# Altium schematic sheet PS_DDR4.SchDoc
size A3
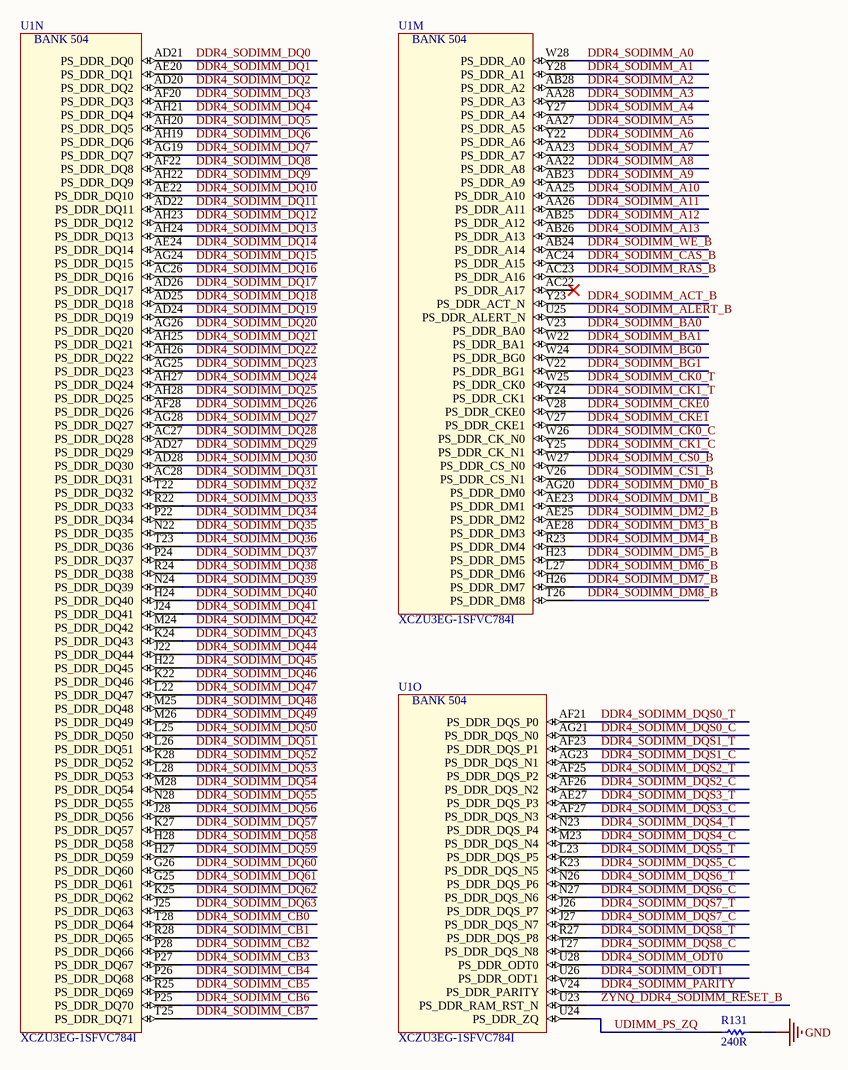
[diagram p0: PS_DDR4.SchDoc]

## Parts
R131  value 240R  [RESC1005L_0402]  (hidden comment: RES0402_240R_0W1_1T)
U1  XCZU3EG-1SFVC784I  [BGA784x28]  (parts M,N,O of 22)

## Nets
GND: R131.1
DDR4_SODIMM_A0: U1.W28(PS_DDR_A0)
DDR4_SODIMM_A1: U1.Y28(PS_DDR_A1)
DDR4_SODIMM_A2: U1.AB28(PS_DDR_A2)
DDR4_SODIMM_A3: U1.AA28(PS_DDR_A3)
DDR4_SODIMM_A4: U1.Y27(PS_DDR_A4)
DDR4_SODIMM_A5: U1.AA27(PS_DDR_A5)
DDR4_SODIMM_A6: U1.Y22(PS_DDR_A6)
DDR4_SODIMM_A7: U1.AA23(PS_DDR_A7)
DDR4_SODIMM_A8: U1.AA22(PS_DDR_A8)
DDR4_SODIMM_A9: U1.AB23(PS_DDR_A9)
DDR4_SODIMM_A10: U1.AA25(PS_DDR_A10)
DDR4_SODIMM_A11: U1.AA26(PS_DDR_A11)
DDR4_SODIMM_A12: U1.AB25(PS_DDR_A12)
DDR4_SODIMM_A13: U1.AB26(PS_DDR_A13)
DDR4_SODIMM_ACT_B: U1.Y23(PS_DDR_ACT_N)
DDR4_SODIMM_ALERT_B: U1.U25(PS_DDR_ALERT_N)
DDR4_SODIMM_BA0: U1.V23(PS_DDR_BA0)
DDR4_SODIMM_BA1: U1.W22(PS_DDR_BA1)
DDR4_SODIMM_BG0: U1.W24(PS_DDR_BG0)
DDR4_SODIMM_BG1: U1.V22(PS_DDR_BG1)
DDR4_SODIMM_CAS_B: U1.AC24(PS_DDR_A15)
DDR4_SODIMM_CB0: U1.T28(PS_DDR_DQ64)
DDR4_SODIMM_CB1: U1.R28(PS_DDR_DQ65)
DDR4_SODIMM_CB2: U1.P28(PS_DDR_DQ66)
DDR4_SODIMM_CB3: U1.P27(PS_DDR_DQ67)
DDR4_SODIMM_CB4: U1.P26(PS_DDR_DQ68)
DDR4_SODIMM_CB5: U1.R25(PS_DDR_DQ69)
DDR4_SODIMM_CB6: U1.P25(PS_DDR_DQ70)
DDR4_SODIMM_CB7: U1.T25(PS_DDR_DQ71)
DDR4_SODIMM_CK0_C: U1.W26(PS_DDR_CK_N0)
DDR4_SODIMM_CK0_T: U1.W25(PS_DDR_CK0)
DDR4_SODIMM_CK1_C: U1.Y25(PS_DDR_CK_N1)
DDR4_SODIMM_CK1_T: U1.Y24(PS_DDR_CK1)
DDR4_SODIMM_CKE0: U1.V28(PS_DDR_CKE0)
DDR4_SODIMM_CKE1: U1.V27(PS_DDR_CKE1)
DDR4_SODIMM_CS0_B: U1.W27(PS_DDR_CS_N0)
DDR4_SODIMM_CS1_B: U1.V26(PS_DDR_CS_N1)
DDR4_SODIMM_DM0_B: U1.AG20(PS_DDR_DM0)
DDR4_SODIMM_DM1_B: U1.AE23(PS_DDR_DM1)
DDR4_SODIMM_DM2_B: U1.AE25(PS_DDR_DM2)
DDR4_SODIMM_DM3_B: U1.AE28(PS_DDR_DM3)
DDR4_SODIMM_DM4_B: U1.R23(PS_DDR_DM4)
DDR4_SODIMM_DM5_B: U1.H23(PS_DDR_DM5)
DDR4_SODIMM_DM6_B: U1.L27(PS_DDR_DM6)
DDR4_SODIMM_DM7_B: U1.H26(PS_DDR_DM7)
DDR4_SODIMM_DM8_B: U1.T26(PS_DDR_DM8)
DDR4_SODIMM_DQ0: U1.AD21(PS_DDR_DQ0)
DDR4_SODIMM_DQ1: U1.AE20(PS_DDR_DQ1)
DDR4_SODIMM_DQ2: U1.AD20(PS_DDR_DQ2)
DDR4_SODIMM_DQ3: U1.AF20(PS_DDR_DQ3)
DDR4_SODIMM_DQ4: U1.AH21(PS_DDR_DQ4)
DDR4_SODIMM_DQ5: U1.AH20(PS_DDR_DQ5)
DDR4_SODIMM_DQ6: U1.AH19(PS_DDR_DQ6)
DDR4_SODIMM_DQ7: U1.AG19(PS_DDR_DQ7)
DDR4_SODIMM_DQ8: U1.AF22(PS_DDR_DQ8)
DDR4_SODIMM_DQ9: U1.AH22(PS_DDR_DQ9)
DDR4_SODIMM_DQ10: U1.AE22(PS_DDR_DQ10)
DDR4_SODIMM_DQ11: U1.AD22(PS_DDR_DQ11)
DDR4_SODIMM_DQ12: U1.AH23(PS_DDR_DQ12)
DDR4_SODIMM_DQ13: U1.AH24(PS_DDR_DQ13)
DDR4_SODIMM_DQ14: U1.AE24(PS_DDR_DQ14)
DDR4_SODIMM_DQ15: U1.AG24(PS_DDR_DQ15)
DDR4_SODIMM_DQ16: U1.AC26(PS_DDR_DQ16)
DDR4_SODIMM_DQ17: U1.AD26(PS_DDR_DQ17)
DDR4_SODIMM_DQ18: U1.AD25(PS_DDR_DQ18)
DDR4_SODIMM_DQ19: U1.AD24(PS_DDR_DQ19)
DDR4_SODIMM_DQ20: U1.AG26(PS_DDR_DQ20)
DDR4_SODIMM_DQ21: U1.AH25(PS_DDR_DQ21)
DDR4_SODIMM_DQ22: U1.AH26(PS_DDR_DQ22)
DDR4_SODIMM_DQ23: U1.AG25(PS_DDR_DQ23)
DDR4_SODIMM_DQ24: U1.AH27(PS_DDR_DQ24)
DDR4_SODIMM_DQ25: U1.AH28(PS_DDR_DQ25)
DDR4_SODIMM_DQ26: U1.AF28(PS_DDR_DQ26)
DDR4_SODIMM_DQ27: U1.AG28(PS_DDR_DQ27)
DDR4_SODIMM_DQ28: U1.AC27(PS_DDR_DQ28)
DDR4_SODIMM_DQ29: U1.AD27(PS_DDR_DQ29)
DDR4_SODIMM_DQ30: U1.AD28(PS_DDR_DQ30)
DDR4_SODIMM_DQ31: U1.AC28(PS_DDR_DQ31)
DDR4_SODIMM_DQ32: U1.T22(PS_DDR_DQ32)
DDR4_SODIMM_DQ33: U1.R22(PS_DDR_DQ33)
DDR4_SODIMM_DQ34: U1.P22(PS_DDR_DQ34)
DDR4_SODIMM_DQ35: U1.N22(PS_DDR_DQ35)
DDR4_SODIMM_DQ36: U1.T23(PS_DDR_DQ36)
DDR4_SODIMM_DQ37: U1.P24(PS_DDR_DQ37)
DDR4_SODIMM_DQ38: U1.R24(PS_DDR_DQ38)
DDR4_SODIMM_DQ39: U1.N24(PS_DDR_DQ39)
DDR4_SODIMM_DQ40: U1.H24(PS_DDR_DQ40)
DDR4_SODIMM_DQ41: U1.J24(PS_DDR_DQ41)
DDR4_SODIMM_DQ42: U1.M24(PS_DDR_DQ42)
DDR4_SODIMM_DQ43: U1.K24(PS_DDR_DQ43)
DDR4_SODIMM_DQ44: U1.J22(PS_DDR_DQ44)
DDR4_SODIMM_DQ45: U1.H22(PS_DDR_DQ45)
DDR4_SODIMM_DQ46: U1.K22(PS_DDR_DQ46)
DDR4_SODIMM_DQ47: U1.L22(PS_DDR_DQ47)
DDR4_SODIMM_DQ48: U1.M25(PS_DDR_DQ48)
DDR4_SODIMM_DQ49: U1.M26(PS_DDR_DQ49)
DDR4_SODIMM_DQ50: U1.L25(PS_DDR_DQ50)
DDR4_SODIMM_DQ51: U1.L26(PS_DDR_DQ51)
DDR4_SODIMM_DQ52: U1.K28(PS_DDR_DQ52)
DDR4_SODIMM_DQ53: U1.L28(PS_DDR_DQ53)
DDR4_SODIMM_DQ54: U1.M28(PS_DDR_DQ54)
DDR4_SODIMM_DQ55: U1.N28(PS_DDR_DQ55)
DDR4_SODIMM_DQ56: U1.J28(PS_DDR_DQ56)
DDR4_SODIMM_DQ57: U1.K27(PS_DDR_DQ57)
DDR4_SODIMM_DQ58: U1.H28(PS_DDR_DQ58)
DDR4_SODIMM_DQ59: U1.H27(PS_DDR_DQ59)
DDR4_SODIMM_DQ60: U1.G26(PS_DDR_DQ60)
DDR4_SODIMM_DQ61: U1.G25(PS_DDR_DQ61)
DDR4_SODIMM_DQ62: U1.K25(PS_DDR_DQ62)
DDR4_SODIMM_DQ63: U1.J25(PS_DDR_DQ63)
DDR4_SODIMM_DQS0_C: U1.AG21(PS_DDR_DQS_N0)
DDR4_SODIMM_DQS0_T: U1.AF21(PS_DDR_DQS_P0)
DDR4_SODIMM_DQS1_C: U1.AG23(PS_DDR_DQS_N1)
DDR4_SODIMM_DQS1_T: U1.AF23(PS_DDR_DQS_P1)
DDR4_SODIMM_DQS2_C: U1.AF26(PS_DDR_DQS_N2)
DDR4_SODIMM_DQS2_T: U1.AF25(PS_DDR_DQS_P2)
DDR4_SODIMM_DQS3_C: U1.AF27(PS_DDR_DQS_N3)
DDR4_SODIMM_DQS3_T: U1.AE27(PS_DDR_DQS_P3)
DDR4_SODIMM_DQS4_C: U1.M23(PS_DDR_DQS_N4)
DDR4_SODIMM_DQS4_T: U1.N23(PS_DDR_DQS_P4)
DDR4_SODIMM_DQS5_C: U1.K23(PS_DDR_DQS_N5)
DDR4_SODIMM_DQS5_T: U1.L23(PS_DDR_DQS_P5)
DDR4_SODIMM_DQS6_C: U1.N27(PS_DDR_DQS_N6)
DDR4_SODIMM_DQS6_T: U1.N26(PS_DDR_DQS_P6)
DDR4_SODIMM_DQS7_C: U1.J27(PS_DDR_DQS_N7)
DDR4_SODIMM_DQS7_T: U1.J26(PS_DDR_DQS_P7)
DDR4_SODIMM_DQS8_C: U1.T27(PS_DDR_DQS_N8)
DDR4_SODIMM_DQS8_T: U1.R27(PS_DDR_DQS_P8)
DDR4_SODIMM_ODT0: U1.U28(PS_DDR_ODT0)
DDR4_SODIMM_ODT1: U1.U26(PS_DDR_ODT1)
DDR4_SODIMM_PARITY: U1.V24(PS_DDR_PARITY)
DDR4_SODIMM_RAS_B: U1.AC23(PS_DDR_A16)
DDR4_SODIMM_WE_B: U1.AB24(PS_DDR_A14)
UDIMM_PS_ZQ: R131.2 U1.U24(PS_DDR_ZQ)
ZYNQ_DDR4_SODIMM_RESET_B: U1.U23(PS_DDR_RAM_RST_N)

Not connected (* = marked no-connect by the designer): U1 AC22(PS_DDR_A17)*

## Notes on the sheet
- (in symbol XCZU3EG-1SFVC784I, part M) BANK 504
- (in symbol XCZU3EG-1SFVC784I, part N) BANK 504
- (in symbol XCZU3EG-1SFVC784I, part O) BANK 504

## Library data of the parts
R131 = RES0402_240R_0W1_1T: RES SMD 240 OHM 1% 1/10W 0402; Manufacturer 1: Panasonic Electronic Components; Manufacturer Part Number 1: ERJ-2RKF2400X; Package: 0402; ComponentLink1Description: Datasheet; Power: 1/10W; Tolerance: 1%; Supplier 1: Digi-Key; Supplier Part Number 1: P240LCT-ND
U1 = XCZU3EG-1SFVC784I: IC FPGA 252 I/O 784FCBGA - XILINX ZYNQ ULTRASCALE+; Manufacturer 1: Xilinx Inc.; Package: SFVC784; ComponentLink1Description: Datasheet; Supplier 1: Digi-Key; Supplier Part Number 1: XCZU3EG-1SFVC784I-ND; Manufacturer Part Number 1: XCZU3EG-1SFVC784I